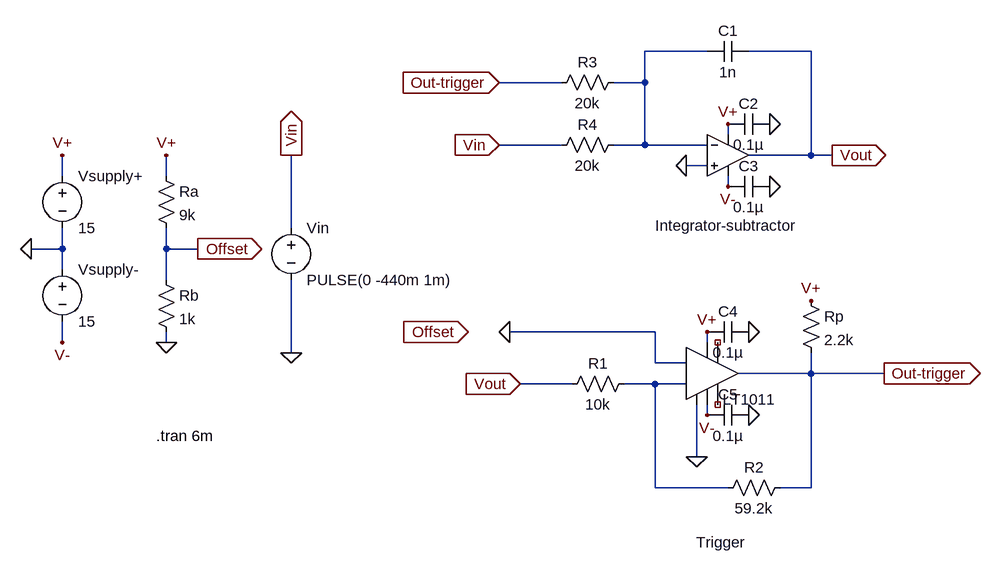
[diagram p0: schematic VCO-final-circuit.asc]
VCO-final-circuit.asc, the LTspice schematic file:
Version 4
SHEET 1 1784 680
WIRE 1312 -272 1216 -272
WIRE 1472 -272 1376 -272
WIRE 1088 -224 992 -224
WIRE 1216 -224 1216 -272
WIRE 1216 -224 1168 -224
WIRE 1344 -144 1344 -160
WIRE 1088 -128 992 -128
WIRE 1216 -128 1216 -224
WIRE 1216 -128 1168 -128
WIRE 1312 -128 1216 -128
WIRE 1472 -112 1472 -272
WIRE 1472 -112 1376 -112
WIRE 1504 -112 1472 -112
WIRE 1312 -96 1280 -96
WIRE 320 -80 320 -112
WIRE 480 -80 480 -112
WIRE 1344 -64 1344 -80
WIRE 672 0 672 -112
WIRE 320 32 320 0
WIRE 320 32 272 32
WIRE 480 32 480 0
WIRE 528 32 480 32
WIRE 320 64 320 32
WIRE 480 80 480 32
WIRE 1232 160 1008 160
WIRE 320 176 320 144
WIRE 480 176 480 160
WIRE 1312 176 1312 160
WIRE 672 192 672 80
WIRE 1232 208 1232 160
WIRE 1280 208 1232 208
WIRE 1472 224 1472 192
WIRE 1472 224 1360 224
WIRE 1584 224 1472 224
WIRE 1104 240 1024 240
WIRE 1232 240 1184 240
WIRE 1280 240 1232 240
WIRE 1312 288 1312 272
WIRE 1296 352 1296 272
WIRE 1232 400 1232 240
WIRE 1344 400 1232 400
WIRE 1472 400 1472 224
WIRE 1472 400 1424 400
FLAG 272 32 0
FLAG 320 -112 V+
FLAG 320 176 V-
FLAG 1280 -96 0
FLAG 1344 -160 V+
FLAG 1312 160 V+
FLAG 1344 -64 V-
FLAG 1504 -112 Vout
IOPIN 1504 -112 Out
FLAG 992 -224 Out-trigger
IOPIN 992 -224 In
FLAG 1296 352 0
FLAG 1312 288 V-
FLAG 1472 112 V+
FLAG 480 176 0
FLAG 528 32 Offset
IOPIN 528 32 Out
FLAG 992 -128 Vin
IOPIN 992 -128 In
FLAG 1584 224 Out-trigger
IOPIN 1584 224 Out
FLAG 944 160 Offset
IOPIN 944 160 In
FLAG 1024 240 Vout
IOPIN 1024 240 In
FLAG 672 192 0
FLAG 672 -112 Vin
IOPIN 672 -112 Out
FLAG 480 -112 V+
FLAG 1008 160 0
FLAG 1408 -160 0
FLAG 1408 -64 0
FLAG 1376 288 0
FLAG 1376 160 0
SYMBOL voltage 320 -96 R0
SYMATTR InstName Vsupply+
SYMATTR Value 15
SYMBOL voltage 320 48 R0
SYMATTR InstName Vsupply-
SYMATTR Value 15
SYMBOL res 1184 -144 R90
WINDOW 0 0 56 VBottom 2
WINDOW 3 32 56 VTop 2
SYMATTR InstName R4
SYMATTR Value 20k
SYMATTR SpiceLine tol=5
SYMBOL cap 1376 -288 R90
WINDOW 0 0 32 VBottom 2
WINDOW 3 32 32 VTop 2
SYMATTR InstName C1
SYMATTR Value 1n
SYMBOL res 1200 224 R90
WINDOW 0 0 56 VBottom 2
WINDOW 3 32 56 VTop 2
SYMATTR InstName R1
SYMATTR Value 10k
SYMATTR SpiceLine tol=1
SYMBOL Comparators/LT1011 1312 224 R0
WINDOW 0 -17 260 Left 2
SYMATTR InstName Trigger
SYMBOL res 1440 384 R90
WINDOW 0 0 56 VBottom 2
WINDOW 3 32 56 VTop 2
SYMATTR InstName R2
SYMATTR Value 59.2k
SYMATTR SpiceLine tol=5
SYMBOL res 1456 96 R0
SYMATTR InstName Rp
SYMATTR Value 2.2k
SYMATTR SpiceLine tol=5
SYMBOL Opamps/UniversalOpamp2 1344 -112 R0
WINDOW 0 -112 108 Left 2
SYMATTR InstName Integrator-subtractor
SYMBOL res 1184 -240 R90
WINDOW 0 0 56 VBottom 2
WINDOW 3 32 56 VTop 2
SYMATTR InstName R3
SYMATTR Value 20k
SYMATTR SpiceLine tol=5
SYMBOL res 464 -96 R0
SYMATTR InstName Ra
SYMATTR Value 9k
SYMBOL res 464 64 R0
SYMATTR InstName Rb
SYMATTR Value 1k
SYMBOL voltage 672 -16 R0
WINDOW 123 0 0 Left 2
WINDOW 39 0 0 Left 2
SYMATTR InstName Vin
SYMATTR Value PULSE(0 -440m 1m)
SYMBOL cap 1408 -176 R90
WINDOW 0 0 32 VBottom 2
WINDOW 3 32 32 VTop 2
SYMATTR InstName C2
SYMATTR Value 0.1µ
SYMBOL cap 1408 -80 R90
WINDOW 0 0 32 VBottom 2
WINDOW 3 32 32 VTop 2
SYMATTR InstName C3
SYMATTR Value 0.1µ
SYMBOL cap 1376 144 R90
WINDOW 0 0 32 VBottom 2
WINDOW 3 32 32 VTop 2
SYMATTR InstName C4
SYMATTR Value 0.1µ
SYMBOL cap 1376 272 R90
WINDOW 0 0 32 VBottom 2
WINDOW 3 32 32 VTop 2
SYMATTR InstName C5
SYMATTR Value 0.1µ
TEXT 464 320 Left 2 !.tran 6m

The netlist it stands for:
* VCO-final-circuit.asc
Vsupply+ V+ 0 15
Vsupply- 0 V- 15
R4 N001 Vin 20k tol=5
C1 Vout N001 1n
R1 N002 Vout 10k tol=1
XTrigger 0 N002 0 V- NC_01 NC_02 Out-trigger V+ LT1011
R2 Out-trigger N002 59.2k tol=5
Rp V+ Out-trigger 2.2k tol=5
XIntegrator-subtractor 0 N001 V+ V- Vout level.2 Avol=1Meg GBW=10Meg Slew=10Meg ilimit=25m rail=0 Vos=0 phimargin=45 en=0 enk=0 in=0 ink=0 Rin=500Meg  ; pins IN+ IN- V+ V- OUT
R3 N001 Out-trigger 20k tol=5
Ra V+ Offset 9k
Rb Offset 0 1k
Vin Vin 0 PULSE(0 -440m 1m)
C2 0 V+ 0.1µ
C3 0 V- 0.1µ
C4 0 V+ 0.1µ
C5 0 V- 0.1µ
.tran 6m
.lib LTC1.lib
.lib UniversalOpamps2.sub
.backanno
.end